# Altium project RAMBo.PrjPcb (part 2 of 2)

## Sheet Connectors.SchDoc
size Letter; SheetNumber: 2
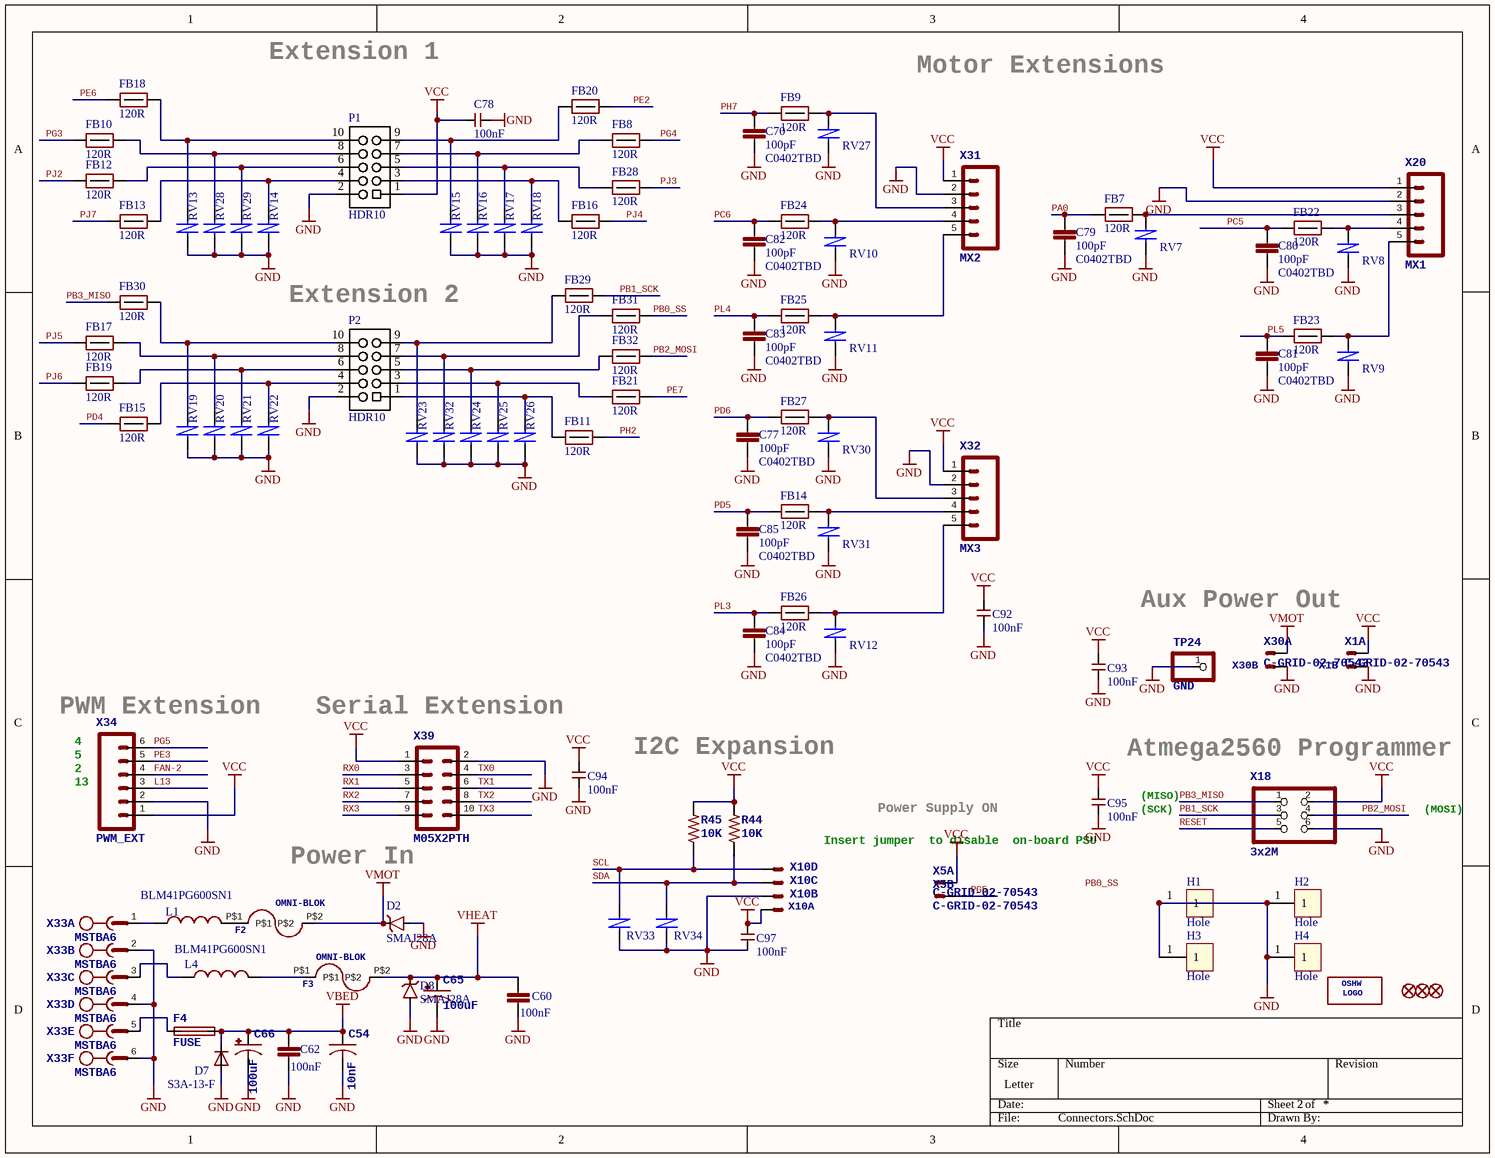
[diagram p5: Connectors.SchDoc]

### Parts
C54  10nF  [C0603]
C60  100nF  [C0603]
C62  100nF  [C0603]
C65  100uF  [E3,5-8]
C66  100uF  [E3,5-8]
C70  100pF  value C0402TBD  [C0402]
C77  100pF  value C0402TBD  [C0402]
C78  100nF  [C0402]
C79  100pF  value C0402TBD  [C0402]
C80  100pF  value C0402TBD  [C0402]
C81  100pF  value C0402TBD  [C0402]
C82  100pF  value C0402TBD  [C0402]
C83  100pF  value C0402TBD  [C0402]
C84  100pF  value C0402TBD  [C0402]
C85  100pF  value C0402TBD  [C0402]
C92  100nF  [C0402]
C93  100nF  [C0402]
C94  100nF  [C0402]
C95  100nF  [C0402]
C97  100nF  [C0402]
D2  SMAJ28A  [SMA-SM]
D7  S3A-13-F  [DO-214AB]
D8  SMAJ28A  [SMA-SM]
F2  OMNI-BLOK  [OMNI-BLOK]
F3  OMNI-BLOK  [OMNI-BLOK]
F4  FUSE  [FUSE-ATO-SMD]
FB7  120R  [R0402]
FB8  120R  [R0402]
FB9  120R  [R0402]
FB10  120R  [R0402]
FB11  120R  [R0402]
FB12  120R  [R0402]
FB13  120R  [R0402]
FB14  120R  [R0402]
FB15  120R  [R0402]
FB16  120R  [R0402]
FB17  120R  [R0402]
FB18  120R  [R0402]
FB19  120R  [R0402]
FB20  120R  [R0402]
FB21  120R  [R0402]
FB22  120R  [R0402]
FB23  120R  [R0402]
FB24  120R  [R0402]
FB25  120R  [R0402]
FB26  120R  [R0402]
FB27  120R  [R0402]
FB28  120R  [R0402]
FB29  120R  [R0402]
FB30  120R  [R0402]
FB31  120R  [R0402]
FB32  120R  [R0402]
FID1  FIDUCIAL1X2.5  [FIDUCIAL-1X2.5]  (value not drawn)
FID2  FIDUCIAL1X2.5  [FIDUCIAL-1X2.5]  (value not drawn)
FID3  FIDUCIAL1X2.5  [FIDUCIAL-1X2.5]  (value not drawn)
H1  Hole  [Wave_hole_3x7-singleSided]  (no BOM)
H2  Hole  [Wave_hole_3x7-singleSided]  (no BOM)
H3  Hole  [Wave_hole_3x7-singleSided]  (no BOM)
H4  Hole  [Wave_hole_3x7-singleSided]  (no BOM)
L1  BLM41PG600SN1  [L1806]
L4  BLM41PG600SN1  [L1806]
LOGO1  OSHW_LOGO_8MILX0150-NT  [OSHW_8X150_NOTEXT]  (value not drawn)
P1  HDR10  [HDR2X5 IDC]
P2  HDR10  [HDR2X5 IDC]
R44  10K  [R0603]
R45  10K  [R0603]
RV7  VRS0402SR55R101N  [C0402]  (value not drawn)
RV8  VRS0402SR55R101N  [C0402]  (value not drawn)
RV9  VRS0402SR55R101N  [C0402]  (value not drawn)
RV10  VRS0402SR55R101N  [C0402]  (value not drawn)
RV11  VRS0402SR55R101N  [C0402]  (value not drawn)
RV12  VRS0402SR55R101N  [C0402]  (value not drawn)
RV13  VRS0402SR55R101N  [C0402]  (value not drawn)
RV14  VRS0402SR55R101N  [C0402]  (value not drawn)
RV15  VRS0402SR55R101N  [C0402]  (value not drawn)
RV16  VRS0402SR55R101N  [C0402]  (value not drawn)
RV17  VRS0402SR55R101N  [C0402]  (value not drawn)
RV18  VRS0402SR55R101N  [C0402]  (value not drawn)
RV19  VRS0402SR55R101N  [C0402]  (value not drawn)
RV20  VRS0402SR55R101N  [C0402]  (value not drawn)
RV21  VRS0402SR55R101N  [C0402]  (value not drawn)
RV22  VRS0402SR55R101N  [C0402]  (value not drawn)
RV23  VRS0402SR55R101N  [C0402]  (value not drawn)
RV24  VRS0402SR55R101N  [C0402]  (value not drawn)
RV25  VRS0402SR55R101N  [C0402]  (value not drawn)
RV26  VRS0402SR55R101N  [C0402]  (value not drawn)
RV27  VRS0402SR55R101N  [C0402]  (value not drawn)
RV28  VRS0402SR55R101N  [C0402]  (value not drawn)
RV29  VRS0402SR55R101N  [C0402]  (value not drawn)
RV30  VRS0402SR55R101N  [C0402]  (value not drawn)
RV31  VRS0402SR55R101N  [C0402]  (value not drawn)
RV32  VRS0402SR55R101N  [C0402]  (value not drawn)
RV33  VRS0402SR55R101N  [C0402]  (value not drawn)
RV34  VRS0402SR55R101N  [C0402]  (value not drawn)
TP24  GND  [1X01]
X1  C-GRID-02-70543  [70543-02]  (parts A,B of 2)
X5  C-GRID-02-70543  [70543-02]  (parts A,B of 2)
X10  C-GRID-04-70543  [70543-04]  (value not drawn)  (parts A,B,C,D of 4)
X18  3x2M  [2X03]
X20  MX1  [1X05]
X30  C-GRID-02-70543  [70543-02]  (parts A,B of 2)
X31  MX2  [1X05]
X32  MX3  [1X05]
X33  MSTBA6  [MSTBA6]  (parts A,B,C,D,E,F of 6)
X34  PWM_EXT  [1X06]
X39  M05X2PTH  [AVR_ICSP]

### Nets
GND: C54.2 C60.2 C62.2 C65.- C66.- C70.2 C77.2 C78.1 C79.2 C80.2 C81.2 C82.2 C83.2 C84.2 C85.2 C92.1 C93.1 C94.1 C95.1 C97.2 D2.A D7.A D8.A H1.1 H2.1 H3.1 H4.1 P1.2 P2.2 RV7.1 RV8.1 RV9.1 RV10.1 RV11.1 RV12.1 RV13.2 RV14.2 RV15.2 RV16.1 RV17.2 RV18.1 RV19.2 RV20.2 RV21.2 RV22.2 RV23.1 RV24.1 RV25.1 RV26.1 RV27.1 RV28.2 RV29.2 RV30.1 RV31.1 RV32.1 RV33.1 RV34.1 TP24.1 X1.1(S) X10.2(S) X18.6 X20.2 X30.1(S) X31.2 X32.2 X33.2 X33.4 X33.6 X34.2 X39.2
VBED: C54.1 C62.1 C66.+ D7.C F4.P$2
VCC: C78.2 C92.2 C93.2 C94.2 C95.2 C97.1 P1.1 R44.2 R45.2 X1.2(S) X5.2(S) X10.1(S) X18.2 X20.1 X31.1 X32.1 X34.1 X39.1
VHEAT: C60.1 C65.+ D8.K F3.P$2
VMOT: D2.K F2.P$2 X30.2(S)
FAN-2: X34.4
L13: X34.3
PA0: C79.1 FB7.1
PB0_SS: FB31.1
PB1_SCK: FB29.1 X18.3
PB2_MOSI: FB32.1 X18.4
PB3_MISO: FB30.2 X18.1
PC5: C80.1 FB22.1
PC6: C82.1 FB24.1
PD4: FB15.2
PD5: C85.1 FB14.2
PD6: C77.1 FB27.2
PE2: FB20.2
PE3: X34.5
PE6: FB18.2
PE7: FB21.1
PG3: FB10.1
PG4: FB8.1
PG5: X5.1(S) X34.6
PH2: FB11.1
PH7: C70.1 FB9.2
PJ2: FB12.1
PJ3: FB28.1
PJ4: FB16.1
PJ5: FB17.1
PJ6: FB19.1
PJ7: FB13.1
PL3: C84.1 FB26.1
PL4: C83.1 FB25.1
PL5: C81.1 FB23.1
RESET: X18.5
RX0: X39.3
RX1: X39.5
RX2: X39.7
RX3: X39.9
SCL: R45.1 RV33.2 X10.4(S)
SDA: R44.1 RV34.2 X10.3(S)
TX0: X39.4
TX1: X39.6
TX2: X39.8
TX3: X39.10
NetF2_P$1: F2.P$1 L1.2
NetF3_P$1: F3.P$1 L4.2
NetF4_P$1: F4.P$1 X33.5
NetFB7_2: FB7.2 RV7.2 X20.3
NetFB8_2: FB8.2 P1.7 RV16.2
NetFB9_1: FB9.1 RV27.2 X31.3
NetFB10_2: FB10.2 P1.8 RV28.1
NetFB11_2: FB11.2 P2.1 RV26.2
NetFB12_2: FB12.2 P1.6 RV29.1
NetFB13_2: FB13.2 P1.4 RV14.1
NetFB14_1: FB14.1 RV31.2 X32.4
NetFB15_1: FB15.1 P2.4 RV22.1
NetFB16_2: FB16.2 P1.3 RV18.2
NetFB17_2: FB17.2 P2.8 RV20.1
NetFB18_1: FB18.1 P1.10 RV13.1
NetFB19_2: FB19.2 P2.6 RV21.1
NetFB20_1: FB20.1 P1.9 RV15.1
NetFB21_2: FB21.2 P2.3 RV25.2
NetFB22_2: FB22.2 RV8.2 X20.4
NetFB23_2: FB23.2 RV9.2 X20.5
NetFB24_2: FB24.2 RV10.2 X31.4
NetFB25_2: FB25.2 RV11.2 X31.5
NetFB26_2: FB26.2 RV12.2 X32.5
NetFB27_1: FB27.1 RV30.2 X32.3
NetFB28_2: FB28.2 P1.5 RV17.1
NetFB29_2: FB29.2 P2.9 RV23.2
NetFB30_1: FB30.1 P2.10 RV19.1
NetFB31_2: FB31.2 P2.7 RV32.2
NetFB32_2: FB32.2 P2.5 RV24.2
NetL1_1: L1.1 X33.1
NetL4_1: L4.1 X33.3

### Notes on the sheet
- Extension 1
- Motor Extensions
- Extension 2
- Aux Power Out
- (near X34) PWM Extension
- (near X34) 2
- (near X34) 5
- (near X34) 4
- (near X39) Serial Extension
- I2C Expansion
- Atmega2560 Programmer
- (near X34) 13
- Insert jumper
  to disable
  on-board PSU
- Power Supply ON
- (near C95) (SCK)
- (near C95) (MISO)
- (MOSI)
- Power In
- Labels drawn without touching a wire or pin: PB0_SS

### Library data of the parts
C54 = C-USC0603: CAPACITOR, American symbol; MANUFACTURER #: C1608X7R1E103K080AA; Manufacturer: TDK; EE_SPEC: 10nF (0.01uF) 25V capacitor
C60 C62 = C0603C104K5RACTU: CAP CER 0603 100nF 50V 10% X7R; LastRevisionNote: ImportComponents; Published: 23-Apr-2014; Publisher: UltiMachine; LastRevisionDate: 23-Apr-2014; ManufacturerPartNumber: C0603C104K5RACTU; VALUE: 100nF; MANUFACTURER #: C0603C104K5RACTU
C65 C66 = CPOL-USE3.5-8: POLARIZED CAPACITOR, American symbol; MANUFACTURER #: UVZ1H101MPD1TD; Manufacturer: Nichicon; EE_SPEC: Aluminum Electrolytic Capacitors - Leaded 100uF 50V 20% 105c
C70 C77 C79-C85 = C0402TBD: Capacitor Non Polarized; Manufacturer: Murata; MANUFACTURER #: GRM1555C1H101JA01D; LastRevisionNote: ImportComponents; EE_SPEC: 100pF ±5% 50V Ceramic Capacitor C0G, NP0 0402 (1005 Metric); Published: 23-Apr-2014; Publisher: UltiMachine; LastRevisionDate: 23-Apr-2014
C78 C92-C95 C97 = 100nF 0402 16V X7R: CAP CER 0402 100nF 16V 10% X7R; MANUFACTURER: Murata; MANUFACTURER #: GRM155R71C104KA88D; PART: 0.1uF 16V X7R 0402; PART DESCRIPTION: 0.10µF ±10% 16V Ceramic Capacitor X7R 0402 (1005 Metric); VALUE: 100nF; DISTRIBUTOR #: 490-3261-2-ND; DISTRIBUTOR: Digikey; TOLERANCE: 10%; EE_SPEC: 16V
D2 D8 = SMAJ28A: TVS DIODE 28VWM 45.4VC SMA; Manufacturer: Diodes Inc; MANUFACTURER #: SMAJ28A-13-F; EE_SPEC: 28Vrs 45.4Vc; Tolerance: NA; DISTRIBUTOR #: SMAJ28A-FDITR-ND; DISTRIBUTOR: Digi-Key; PART: SMAJ28A; Part Description: TVS DIODE 28VWM 45.4VC SMA; VALUE: SMAJ28A
D7 = S3A-13-F: DIODE DO-214AB; LastRevisionNote: ImportComponents; EE_SPEC: 3A 50V Diode; Published: 23-Apr-2014; Publisher: UltiMachine; LastRevisionDate: 23-Apr-2014; Value: S3A-13-F; MANUFACTURER #: S3A-13-F
F2 F3 = OMNI-BLOK: MANUFACTURER #: 0154005.DR; Manufacturer: Littlefuse; EE_SPEC: 5A fuse/fuse block
F4 = FUSE: MANUFACTURER #: 3587TR; Manufacturer: Keystone; EE_SPEC: FUSE HOLDER, AUTO BLADE, SMT
FB7-FB32 = FERRITE 120R 1A 0402: FERRITE BEAD 120 OHM 0402 1LN; MANUFACTURER: Taiyo Yuden; MANUFACTURER #: BKP1005HS121-T; VALUE: 120Rfb; TOLERANCE: -NA-; EE_SPEC: 1A; DISTRIBUTOR #: 587-1921-2-ND; DISTRIBUTOR: Digikey; PART: FERRITE 120R 1A 0402; PART DESCRIPTION: FERRITE BEAD 120 OHM 0402 1LN
FID1-FID3 = FIDUCIAL1X2.5: Fiducial Alignment PointsVarious fiducial points for machine vision alignment.
L1 L4 = BLM41PG600SN1L: FERRITE BEAD 1806 60ohm; LastRevisionNote: ImportComponents; EE_SPEC: FERRITE CHIP 60 OHM 6000MA 1806; Published: 23-Apr-2014; Publisher: UltiMachine; LastRevisionDate: 23-Apr-2014; ManufacturerPartNumber: BLM41PG600SN1L; MANUFACTURER #: BLM41PG600SN1L
P1 P2 = Header 10PIN 2ROW T-HOLE VERT SHROUDED: CONN HEADER VERT 10POS GOLD; MANUFACTURER #: 302-S101; MANUFACTURER: On Shore; PART DESCRIPTION: 10 Positions Header Connector 0.100" (2.54mm) Through Hole Gold; TOLERANCE: -NA-; DISTRIBUTOR #: ED1543-ND; DISTRIBUTOR: Digikey; PART: HDR10; VALUE: HDR10; EE_SPEC: -NA-
R44 R45 = R-US_R0603: RESISTOR, American symbol; MANUFACTURER #: ERJ-3EKF1002V; Manufacturer: Panasonic; EE_SPEC: 10Kohm 100mW 1% resistor
RV7-RV34 = VRS0402SR55R101N: Multi-Layer Varistor; Manufacturer: Yageo; Part Description: VARISTOR 12V 10A 0402; Value: 12V; EE_SPEC: 5.5Vdc 12Vvar 60pF; Tolerance: NA; DISTRIBUTOR #: 311-1516-2-ND; DISTRIBUTOR: Digi-Key; MANUFACTURER #: VRS0402SR55R101N; PART: 12V
TP24 = PINHD-1X1: Pin header 1x1 for 0.1" spacing   With round pins
X1 X5 X30 = C-GRID-02-70543: CONNECTOR   wire to board 2.54 mm (0.100") pitch header; MANUFACTURER #: 70543-0001; Manufacturer: Molex; EE_SPEC: WIRE-BOARD CONNECTOR HEADER 2POS, 2.54MM; OC_FARNELL: unknown; OC_NEWARK: unknown
X10 = C-GRID-04-70543: CONNECTOR   wire to board 2.54 mm (0.100") pitch header; MANUFACTURER #: 70543-0038; Manufacturer: Molex; EE_SPEC: WIRE-BOARD CONNECTOR HEADER 4POS, 2.54MM; OC_FARNELL: unknown; OC_NEWARK: unknown
X18 = PINHD-2X3: PIN HEADER; MANUFACTURER #: 2213S-06G; EE_SPEC: 2x3 header
X20 X31 X32 = M05PTH: Header 5Standard 5-pin 0.1" header. Use with straight break away headers (SKU : PRT-00116), right angle break away headers (PRT-00553), swiss pins (PRT-00743), machine pins (PRT-00117), and female headers (PRT-00115). Molex polarized connector foot print use with SKU : PRT-08230 with associated crimp pins and housings.; MANUFACTURER #: 2211S-05G; EE_SPEC: 1x5
X33 = MSTBA6: PHOENIX; MPN: 1757284; MANUFACTURER #: 39532-1006; Manufacturer: Molex; MF: FARNELL; EE_SPEC: 6 pin fixed terminal block; OC_FARNELL: 3705213; OC_NEWARK: 71C4165
X34 = M06SIP: Header 6Standard 6-pin 0.1" header. Use with straight break away headers (SKU : PRT-00116), right angle break away headers (PRT-00553), swiss pins (PRT-00743), machine pins (PRT-00117), and female headers (PRT-00115). Molex polarized connector foot print use with SKU : PRT-08094 with associated crimp pins and housings. NOTES ON THE VARIANTS LOCK and LOCK_LONGPADS... This footprint was designed to help hold the alignment of a through-hole component (i.e.  6-pin header) while soldering it into place. You may notice that each hole has been shifted either up or down by 0.005 of an inch from it's more standard position (which is a perfectly straight line). This slight alteration caused the pins (the squares in the middle) to touch the edges of the holes.  Because they are alternating, it causes a "brace" to hold the component in place.  0.005 has proven to be the perfect amount of "off-center" position when using our standard breakaway headers. Although looks a little odd when you look at the bare footprint, once you have a header in there, the alteration is very hard to notice.  Also, if you push a header all the way into place, it is covered up entirely on the bottom side.  This idea of altering the position of holes to aid alignment will be further integrated into the Sparkfun Library for other footprints.  It can help hold any component with 3 or more connection pins.; MANUFACTURER #: 2211S-06G; EE_SPEC: 1x6 header
X39 = M05X2PTH: Header 5x2Standard 10-pin dual row 0.1" header. Commonly used with AVR-ISP. Use with Spark Fun Electronics SKU: PRT-00778; MANUFACTURER #: 2213S-10G; EE_SPEC: 2x5 header
LOGO1 = OSHW_LOGO_8MILX0150-NT: OSHW: OSHW; LOGO: LOGO

## Nets that join several sheets
GND: RAMBo (188 pins), Endstops (24 pins), Connectors (70 pins)
VBED: RAMBo (D10.C R58.2 X11.10 X38.2), Connectors (5 pins)
VCC: RAMBo (47 pins), Endstops (18 pins), Connectors (18 pins)
VHEAT: RAMBo (20 pins), Connectors (C60.1 C65.+ D8.K F3.P$2)
VMOT: RAMBo (26 pins), Connectors (D2.K F2.P$2 X30.2)
FAN-2: RAMBo (R70.1 R71.1 U2.6), Connectors (X34.4)
L13: RAMBo (R33.1 U2.26), Connectors (X34.3)
PA0: RAMBo (U2.78), Connectors (C79.1 FB7.1)
PA1: RAMBo (U2.77), Endstops (C67.1 FB4.1 R16.2)
PA2: RAMBo (U2.76), Endstops (C50.1 FB2.1 R6.2)
PB0_SS: RAMBo (R76.2), Connectors (FB31.1)
PB1_SCK: RAMBo (R75.2 U4.P08), Connectors (FB29.1 X18.3)
PB2_MOSI: RAMBo (R74.2 U4.P07), Connectors (FB32.1 X18.4)
PB3_MISO: RAMBo (R64.2), Connectors (FB30.2 X18.1)
PC5: RAMBo (U2.58), Connectors (C80.1 FB22.1)
PC6: RAMBo (U2.59), Connectors (C82.1 FB24.1)
PC7: RAMBo (U2.60), Endstops (C69.1 FB6.1 R25.2)
PD4: RAMBo (U2.47), Connectors (FB15.2)
PD5: RAMBo (U2.48), Connectors (C85.1 FB14.2)
PD6: RAMBo (U2.49), Connectors (C77.1 FB27.2)
PE2: RAMBo (U2.4), Connectors (FB20.2)
PE3: RAMBo (U2.5), Connectors (X34.5)
PE6: RAMBo (U2.8), Connectors (FB18.2)
PE7: RAMBo (U2.9), Connectors (FB21.1)
PG3: RAMBo (U2.28), Connectors (FB10.1)
PG4: RAMBo (U2.29), Connectors (FB8.1)
PG5: RAMBo (U2.1), Connectors (X5.1 X34.6)
PH2: RAMBo (U2.14), Connectors (FB11.1)
PH7: RAMBo (U2.27), Connectors (C70.1 FB9.2)
PJ2: RAMBo (U2.65), Connectors (FB12.1)
PJ3: RAMBo (U2.66), Connectors (FB28.1)
PJ4: RAMBo (U2.67), Connectors (FB16.1)
PJ5: RAMBo (U2.68), Connectors (FB17.1)
PJ6: RAMBo (U2.69), Connectors (FB19.1)
PJ7: RAMBo (U2.79), Connectors (FB13.1)
PL3: RAMBo (U2.38), Connectors (C84.1 FB26.1)
PL4: RAMBo (U2.39), Connectors (C83.1 FB25.1)
PL5: RAMBo (U2.40), Connectors (C81.1 FB23.1)
RESET: RAMBo (6 pins), Connectors (X18.5)
RX0: RAMBo (R34.2 U2.2), Connectors (X39.3)
RX1: RAMBo (U2.45), Connectors (X39.5)
RX2: RAMBo (U2.12), Connectors (X39.7)
RX3: RAMBo (U2.63), Connectors (X39.9)
SCL: RAMBo (U2.43), Connectors (R45.1 RV33.2 X10.4)
SDA: RAMBo (U2.44), Connectors (R44.1 RV34.2 X10.3)
TX0: RAMBo (U2.3 U10.11), Connectors (X39.4)
TX1: RAMBo (U2.46), Connectors (X39.6)
TX2: RAMBo (U2.13), Connectors (X39.8)
TX3: RAMBo (U2.64), Connectors (X39.10)
X-MIN: RAMBo (U2.25), Endstops (C22.1 FB1.1 R5.2)
Y-MIN: RAMBo (U2.24), Endstops (C61.1 FB3.1 R9.2)
Z-MIN: RAMBo (U2.23), Endstops (C68.1 FB5.1 R21.2)